# EAGLE schematic 3DPOV (Alex Julian's conflicted copy 2015-02-14) (EAGLE 7.0.0)
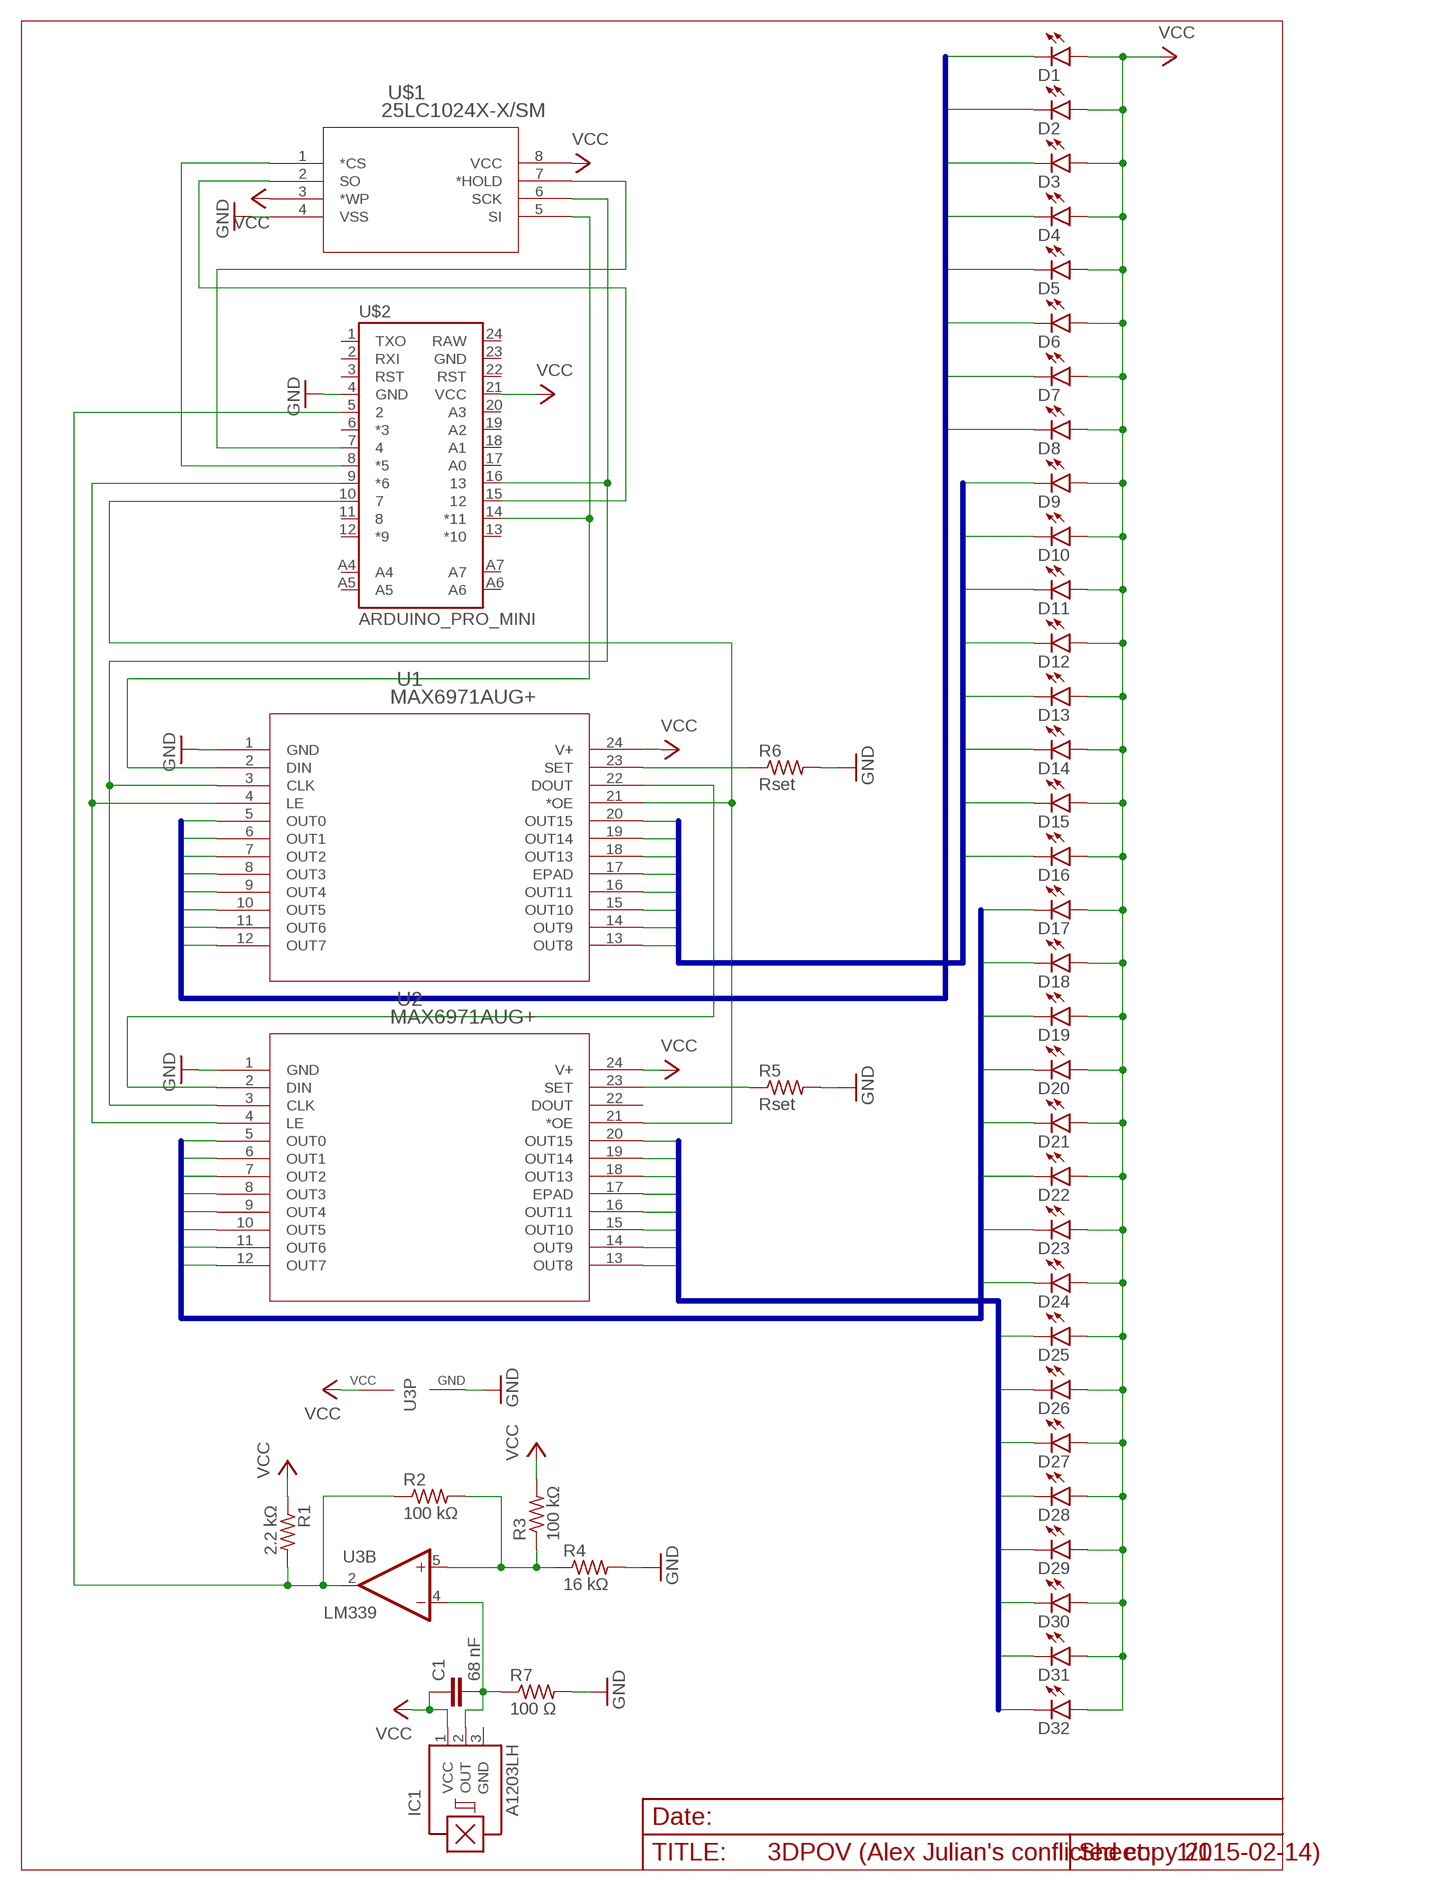
[diagram p0: schematic, sheet 1]

## Parts
C1  68 nF  C2,5-3  [C2.5-3]
D1  LED3MM  [LED3MM]
D2  LED3MM  [LED3MM]
D3  LED3MM  [LED3MM]
D4  LED3MM  [LED3MM]
D5  LED3MM  [LED3MM]
D6  LED3MM  [LED3MM]
D7  LED3MM  [LED3MM]
D8  LED3MM  [LED3MM]
D9  LED3MM  [LED3MM]
D10  LED3MM  [LED3MM]
D11  LED3MM  [LED3MM]
D12  LED3MM  [LED3MM]
D13  LED3MM  [LED3MM]
D14  LED3MM  [LED3MM]
D15  LED3MM  [LED3MM]
D16  LED3MM  [LED3MM]
D17  LED3MM  [LED3MM]
D18  LED3MM  [LED3MM]
D19  LED3MM  [LED3MM]
D20  LED3MM  [LED3MM]
D21  LED3MM  [LED3MM]
D22  LED3MM  [LED3MM]
D23  LED3MM  [LED3MM]
D24  LED3MM  [LED3MM]
D25  LED3MM  [LED3MM]
D26  LED3MM  [LED3MM]
D27  LED3MM  [LED3MM]
D28  LED3MM  [LED3MM]
D29  LED3MM  [LED3MM]
D30  LED3MM  [LED3MM]
D31  LED3MM  [LED3MM]
D32  LED3MM  [LED3MM]
IC1  A1203LH  [SOT23-W]
R1  2.2 kΩ  R-US_0204/7  [0204/7]
R2  100 kΩ  R-US_0204/7  [0204/7]
R3  100 kΩ  R-US_0204/7  [0204/7]
R4  16 kΩ  R-US_0204/7  [0204/7]
R5  Rset  R-US_0204/7  [0204/7]
R6  Rset  R-US_0204/7  [0204/7]
R7  100 Ω  R-US_0204/7  [0204/7]
U1  MAX6971AUG+  [21-0066J_24]
U2  MAX6971AUG+  [21-0066J_24]
U3  LM339  [TSSOP-14]
U$1  25LC1024X-X/SM  [SOIJ8-M_MC]
U$2  ARDUINO_PRO_MINI  [ARDUINO_PRO_MINI]

## Nets
GND: R4.2 R5.2 R6.2 R7.2 U1.1(GND) U2.1(GND) U3.12(P:GND) U$1.4(VSS) U$2.4(GND)
LEDA0: D1.K(C) U1.5(OUT0)
LEDA1: D2.K(C) U1.6(OUT1)
LEDA2: D3.K(C) U1.7(OUT2)
LEDA3: D4.K(C) U1.8(OUT3)
LEDA4: D5.K(C) U1.9(OUT4)
LEDA5: D6.K(C) U1.10(OUT5)
LEDA6: D7.K(C) U1.11(OUT6)
LEDA7: D8.K(C) U1.12(OUT7)
LEDB0: D9.K(C) U1.13(OUT8)
LEDB1: D10.K(C) U1.14(OUT9)
LEDB2: D11.K(C) U1.15(OUT10)
LEDB3: D12.K(C) U1.16(OUT11)
LEDB4: D13.K(C) U1.17(EPAD)
LEDB5: D14.K(C) U1.18(OUT13)
LEDB6: D15.K(C) U1.19(OUT14)
LEDB7: D16.K(C) U1.20(OUT15)
LEDC0: D17.K(C) U2.5(OUT0)
LEDC1: D18.K(C) U2.6(OUT1)
LEDC2: D19.K(C) U2.7(OUT2)
LEDC3: D20.K(C) U2.8(OUT3)
LEDC4: D21.K(C) U2.9(OUT4)
LEDC5: D22.K(C) U2.10(OUT5)
LEDC6: D23.K(C) U2.11(OUT6)
LEDC7: D24.K(C) U2.12(OUT7)
LEDD0: D25.K(C) U2.13(OUT8)
LEDD1: D26.K(C) U2.14(OUT9)
LEDD2: D27.K(C) U2.15(OUT10)
LEDD3: D28.K(C) U2.16(OUT11)
LEDD4: D29.K(C) U2.17(EPAD)
LEDD5: D30.K(C) U2.18(OUT13)
LEDD6: D31.K(C) U2.19(OUT14)
LEDD7: D32.K(C) U2.20(OUT15)
N$1: R6.1 U1.23(SET)
N$2: R5.1 U2.23(SET)
N$3: U1.2(DIN) U$1.5(SI) U$2.14(*11)
N$4: U1.22(DOUT) U2.2(DIN)
N$5: R2.2 R3.1 R4.1 U3.5(B:+IN)
N$6: U$1.2(SO) U$2.15
N$7: R1.2 R2.1 U3.2(B:OUT) U$2.5
N$8: U1.3(CLK) U2.3(CLK) U$1.6(SCK) U$2.16
N$9: U1.21(*OE) U2.21(*OE) U$2.10
N$10: U1.4(LE) U2.4(LE) U$2.9(*6)
N$11: U$1.7(*HOLD) U$2.7
N$12: C1.2 IC1.2(OUT) R7.1 U3.4(B:-IN)
N$13: U$1.1(*CS) U$2.8(*5)
VCC: C1.1 D1.A D2.A D3.A D4.A D5.A D6.A D7.A D8.A D9.A D10.A D11.A D12.A D13.A D14.A D15.A D16.A D17.A D18.A D19.A D20.A D21.A D22.A D23.A D24.A D25.A D26.A D27.A D28.A D29.A D30.A D31.A D32.A IC1.1(VCC) R1.1 R3.2 U1.24(V+) U2.24(V+) U3.3(P:VCC) U$1.3(*WP) U$1.8(VCC) U$2.21(VCC)
Unconnected: U2.22(DOUT) U3.1(A:OUT) U3.6(A:-IN) U3.7(A:+IN) U3.8(C:-IN) U3.9(C:+IN) U3.10(D:-IN) U3.11(D:+IN) U3.13(D:OUT) U3.14(C:OUT) U$2.1(TXO) U$2.2(RXI) U$2.3(RST) U$2.6(*3) U$2.11 U$2.12(*9) U$2.13(*10) U$2.17(A0) U$2.18(A1) U$2.19(A2) U$2.20(A3) U$2.22(RST) U$2.23(GND) U$2.24(RAW) U$2.A4 U$2.A5 U$2.A6 U$2.A7

## Buses
LEDB[0..7]
LEDC[0..7]
LEDD[0..7]
LEDA[0..7]

## Power pins joined to a net without a drawn wire
GND: IC1.3(GND)

## Library data of the parts
C1 = capacitor-wima:C: CAPACITOR naming: grid - package width
D1-D32 = SparkFun-LED:LED: LEDs Standard schematic elements and footprints for 5mm, 3mm, 1206, and 0603 sized LEDs. 5mm - Spark Fun Electronics SKU : COM-00529 (and others)
IC1 = allegro:A12*?: Hall-effect bipolar switch Source: http://www.allegromicro.com/en/Products/Part_Numbers/1202/1202.pdf; MF: ALLEGRO MICROSYSTEMS, INC.; MPN: A1203LLHLT-T; OC_FARNELL: 1791384; OC_NEWARK: 31K6608
R1-R7 = resistor:R-US_: RESISTOR, American symbol
U1 U2 = 3DPOV:MAX6971AUG+; MANUFACTURER_PART_NUMBER: max6971aug+; VENDOR: MAXIM
U3 = SparkFun-AnalogIC:LM339: Based on information from the SLCS006N datasheet from TI (www.ti.com). Change Log Date Author Change July 16, 2008 nick@scantool.net Device created.; DESC: IC, Quad Comparator; MANUF: Texas Instruments; PARTNUM: LM339PWR; SUPPLIER: Digikey:296-6607-1-ND; VALSTAT: PARTNUM
U$1 = 3DPOV:25LC1024X-X/SM
U$2 = SparkFun-Boards:ARDUINO_PRO_MINI